# Altium schematic sheet Scratch.SchDoc
size A; Author: E. Sims; Organization: Let's Build Rockets Inc.; SheetNumber: 6; SheetTotal: 10
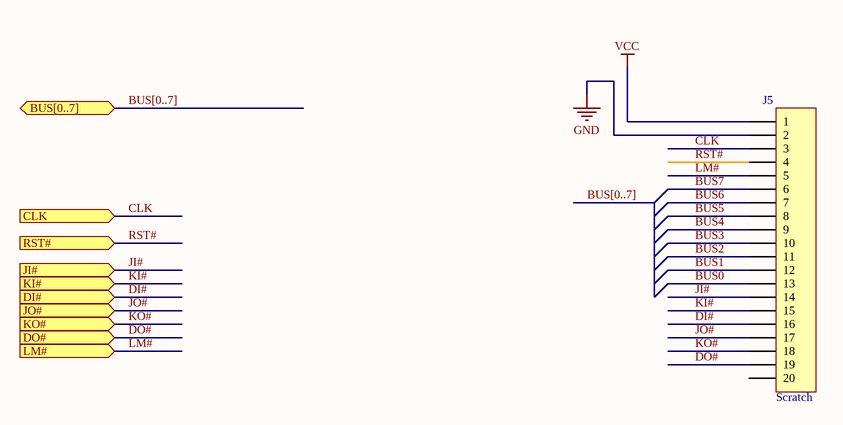
[diagram p0: Scratch.SchDoc]

## Parts
J5  Scratch  [HDR1X20]

## Ports
BUS[0..7] (bidir), CLK (in), DI# (in), DO# (in), JI# (in), JO# (in), KI# (in), KO# (in), LM# (in), RST# (in)

## Nets
GND: J5.2
VCC: J5.1
BUS0: J5.13
BUS1: J5.12
BUS2: J5.11
BUS3: J5.10
BUS4: J5.9
BUS5: J5.8
BUS6: J5.7
BUS7: J5.6
CLK: J5.3 ; port CLK
DI#: J5.16 ; port DI#
DO#: J5.19 ; port DO#
JI#: J5.14 ; port JI#
JO#: J5.17 ; port JO#
KI#: J5.15 ; port KI#
KO#: J5.18 ; port KO#
LM#: J5.5 ; port LM#
RST#: J5.4 ; port RST#

Not connected (* = marked no-connect by the designer): J5 20

## Buses and harness runs
bus BUS[0..7]
bus BUS[0..7] = port BUS[0..7]

## Notes on the sheet
- Let's Build Rocket's Inc. Modular Paylaod System Based on TMP-010 Rev
  For more information visit https://github.com/LetsBuildRockets/Modular-Payload-System
  This work is licensed under CC BY-NC 4.0. To view a copy of this license, visit https://creativecommons.org/licenses/by-nc/4.0
- Title
- Size:
- Date:
- Assembly Variant:
- B
- Number:
- Time:
- Revision:
- Sheet
- of
- Author:
- File:

## Library data of the parts
J5 = Header 20: Header, 20-Pin; System: Connector; LatestRevisionDate: 17-Jul-2002; LatestRevisionNote: Re-released for DXP Platform.; Publisher: Altium Limited